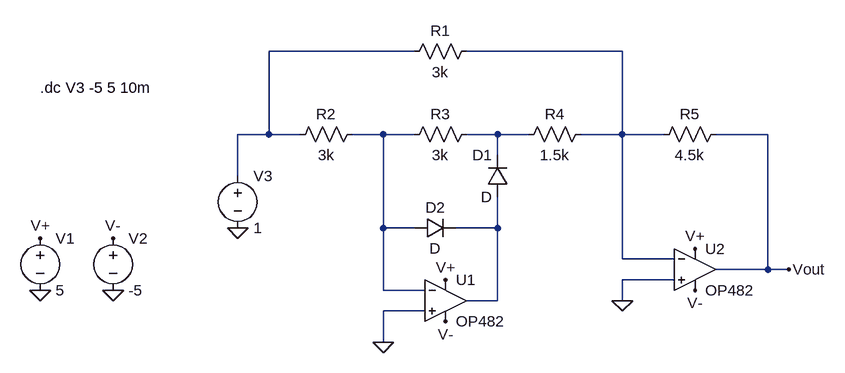
[diagram p0: schematic Etaj4Amplificare.asc]
Etaj4Amplificare.asc, the LTspice schematic file:
Version 4.1
SHEET 1 880 680
WIRE 128 -32 -96 -32
WIRE 448 -32 208 -32
WIRE -96 96 -96 -32
WIRE -96 96 -144 96
WIRE -48 96 -96 96
WIRE 80 96 32 96
WIRE 128 96 80 96
WIRE 256 96 208 96
WIRE 304 96 256 96
WIRE 448 96 448 -32
WIRE 448 96 384 96
WIRE 512 96 448 96
WIRE 672 96 592 96
WIRE 256 128 256 96
WIRE -144 160 -144 96
WIRE 80 240 80 96
WIRE 128 240 80 240
WIRE 256 240 256 192
WIRE 256 240 192 240
WIRE 448 288 448 96
WIRE 528 288 448 288
WIRE 672 304 672 96
WIRE 672 304 592 304
WIRE 704 304 672 304
WIRE 528 320 448 320
WIRE 80 336 80 240
WIRE 144 336 80 336
WIRE 256 352 256 240
WIRE 256 352 208 352
WIRE 448 352 448 320
WIRE 144 368 80 368
WIRE 80 416 80 368
FLAG 448 352 0
FLAG 704 304 Vout
FLAG -448 336 0
FLAG -336 336 0
FLAG -448 256 V+
FLAG -336 256 V-
FLAG 560 272 V+
FLAG 560 336 V-
FLAG 176 320 V+
FLAG 176 384 V-
FLAG 80 416 0
FLAG -144 240 0
SYMBOL res 224 -48 R90
WINDOW 0 0 56 VBottom 2
WINDOW 3 32 56 VTop 2
SYMATTR InstName R1
SYMATTR Value 3k
SYMBOL res 48 80 R90
WINDOW 0 0 56 VBottom 2
WINDOW 3 32 56 VTop 2
SYMATTR InstName R2
SYMATTR Value 3k
SYMBOL res 224 80 R90
WINDOW 0 0 56 VBottom 2
WINDOW 3 32 56 VTop 2
SYMATTR InstName R3
SYMATTR Value 3k
SYMBOL res 400 80 R90
WINDOW 0 0 56 VBottom 2
WINDOW 3 32 56 VTop 2
SYMATTR InstName R4
SYMATTR Value 1.5k
SYMBOL res 608 80 R90
WINDOW 0 0 56 VBottom 2
WINDOW 3 32 56 VTop 2
SYMATTR InstName R5
SYMATTR Value 4.5k
SYMBOL OpAmps\\OP482 176 288 R0
SYMATTR InstName U1
SYMBOL OpAmps\\OP482 560 240 R0
SYMATTR InstName U2
SYMBOL voltage -448 240 R0
WINDOW 123 0 0 Left 0
WINDOW 39 0 0 Left 0
SYMATTR InstName V1
SYMATTR Value 5
SYMBOL voltage -336 240 R0
SYMATTR InstName V2
SYMATTR Value -5
SYMBOL diode 272 192 R180
WINDOW 0 24 64 Left 2
WINDOW 3 24 0 Left 2
SYMATTR InstName D1
SYMBOL diode 128 256 R270
WINDOW 0 32 32 VTop 2
WINDOW 3 0 32 VBottom 2
SYMATTR InstName D2
SYMBOL voltage -144 144 R0
WINDOW 123 0 0 Left 0
WINDOW 39 0 0 Left 0
SYMATTR InstName V3
SYMATTR Value 1
TEXT -448 24 Left 2 !.dc V3 -5 5 10m

The netlist it stands for:
* Etaj4Amplificare.asc
R1 N002 N001 3k
R2 N003 N001 3k
R3 N004 N003 3k
R4 N002 N004 1.5k
R5 Vout N002 4.5k
X§U1 0 N003 V+ V- N005 OP482  ; pins In+ In- V+ V- OUT
X§U2 0 N002 V+ V- Vout OP482  ; pins In+ In- V+ V- OUT
V1 V+ 0 5
V2 V- 0 -5
D1 N005 N004 D
D2 N003 N005 D
V3 N001 0 1
.model D D
.lib standard.dio
.dc V3 -5 5 10m
.backanno
.end